# EAGLE design cnc_shield (EAGLE 5.10)
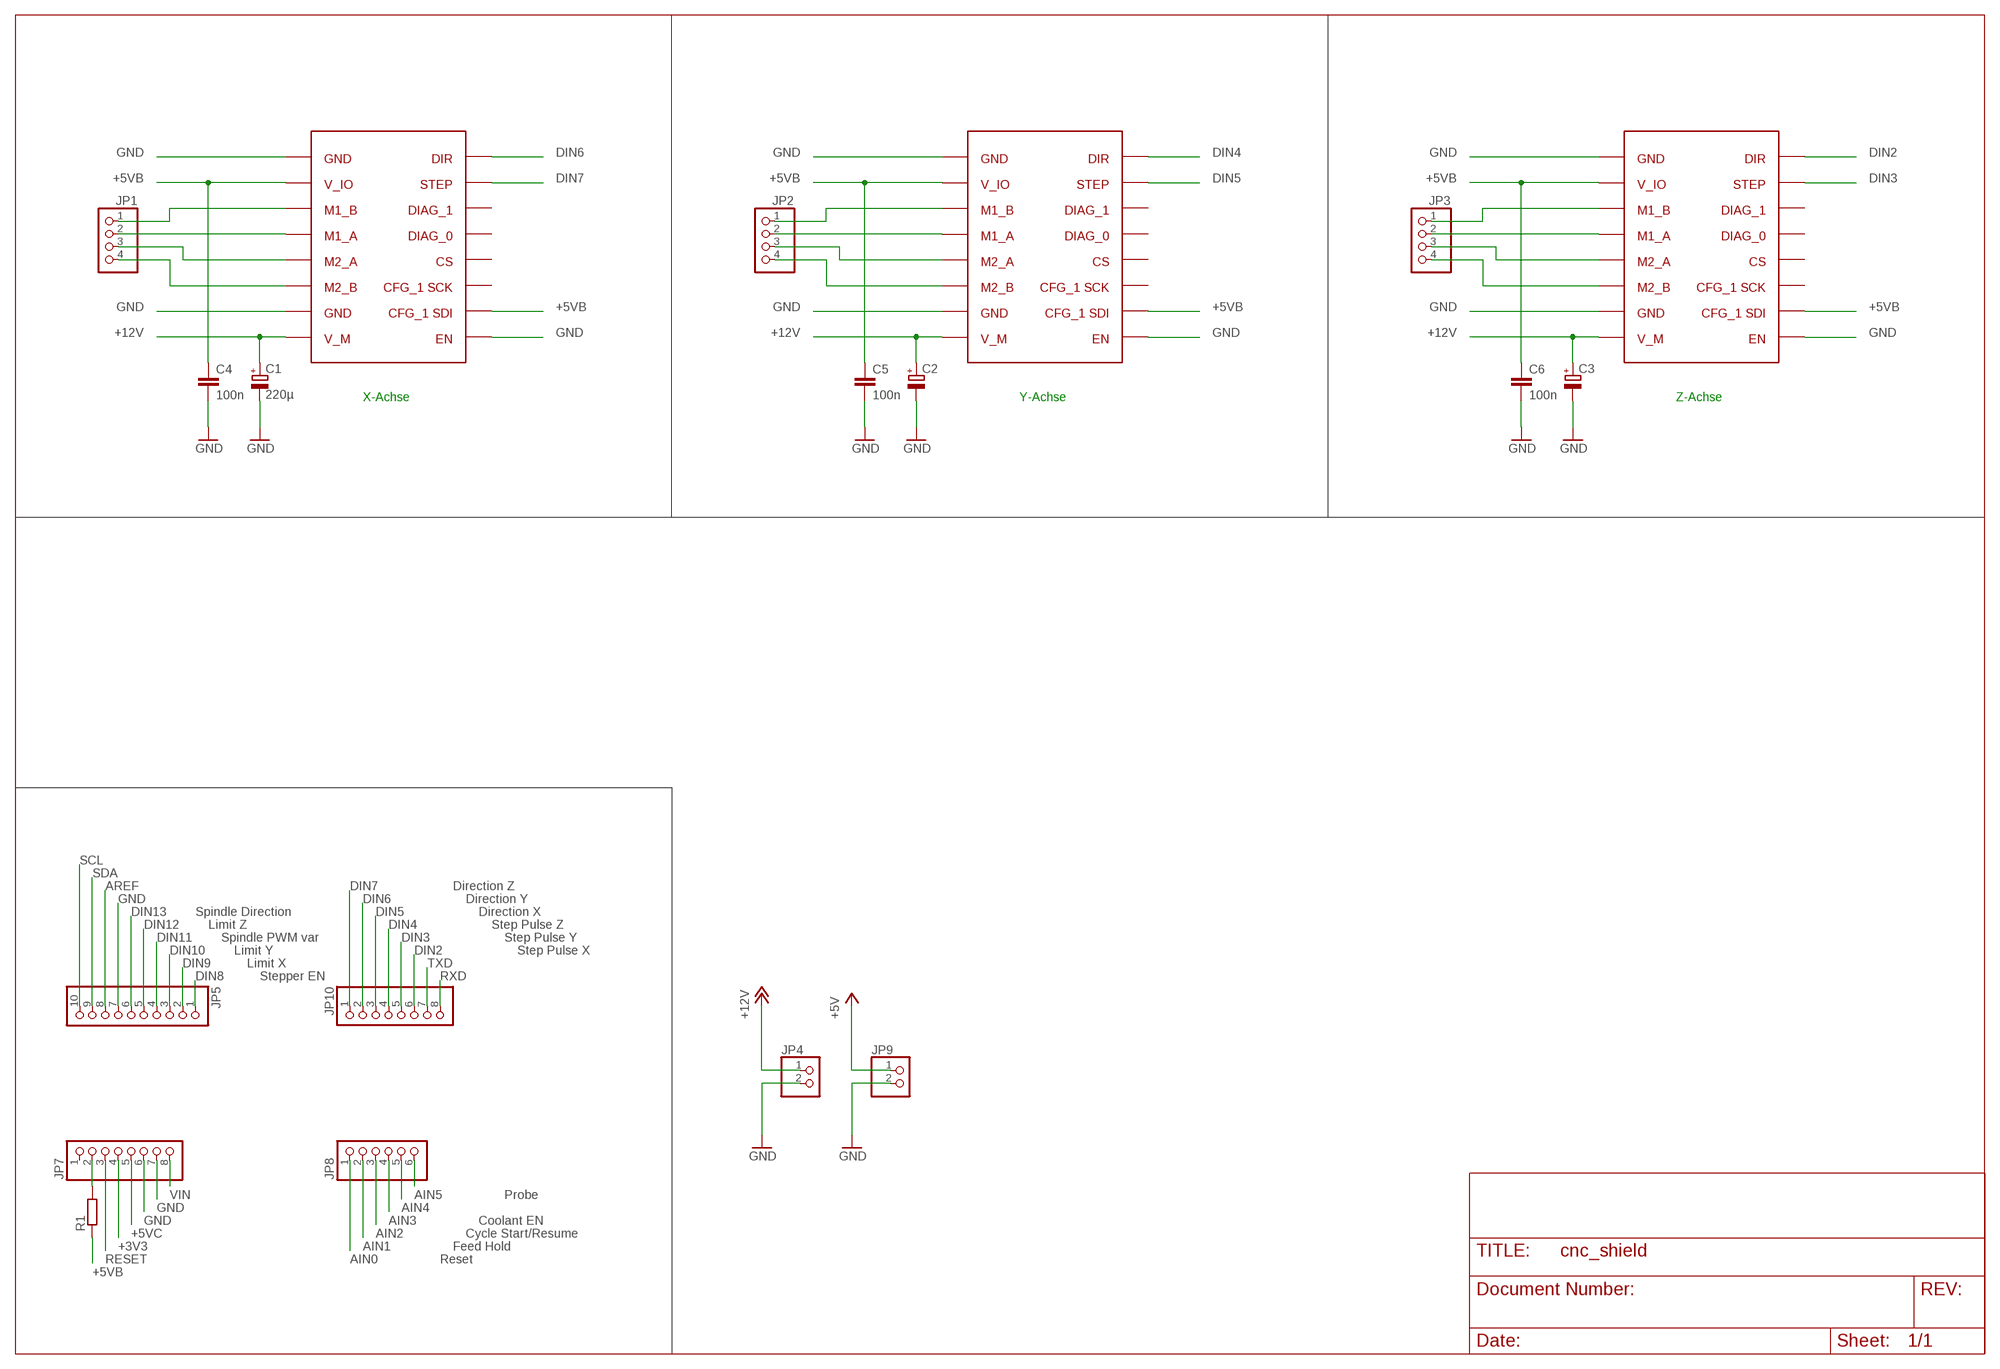
[diagram p0: schematic, sheet 1]

## Parts
C1  220µ  CPOL-EUTT2D4  [TT2D4]
C2  CPOL-EUTT2D4  [TT2D4]
C3  CPOL-EUTT2D4  [TT2D4]
C4  100n  C-EUC0805  [C0805]
C5  100n  C-EUC0805  [C0805]
C6  100n  C-EUC0805  [C0805]
JP1  PINHD-1X4  [1X04]
JP2  PINHD-1X4  [1X04]
JP3  PINHD-1X4  [1X04]
JP4  PINHD-1X2  [1X02]
JP5  PINHD-1X10  [1X10]
JP7  PINHD-1X8  [1X08]
JP8  PINHD-1X6  [1X06]
JP9  PINHD-1X2  [1X02]
JP10  PINHD-1X8  [1X08]
R1  R-EU_M1206  [M1206]
U$1  TMC2130  [TMC2130]
U$2  TMC2130  [TMC2130]
U$3  TMC2130  [TMC2130]

## Nets
+3V3: JP7.4
+5V: JP7.2 JP9.1 R1.2
+5VB: C4.1 C5.1 C6.1 R1.1 U$1.P$2(V_IO) U$1.P$10(CFG0_SDI) U$2.P$2(V_IO) U$2.P$10(CFG0_SDI) U$3.P$2(V_IO) U$3.P$10(CFG0_SDI)
+5VC: JP7.5
+12V: C1.+ C2.+ C3.+ JP4.1 U$1.P$8(V_M) U$2.P$8(V_M) U$3.P$8(V_M)
AIN0: JP8.1
AIN1: JP8.2
AIN2: JP8.3
AIN3: JP8.4
AIN4: JP8.5
AIN5: JP8.6
AREF: JP5.8
DIN2: JP10.6 U$3.P$16(DIR)
DIN3: JP10.5 U$3.P$15(STEP)
DIN4: JP10.4 U$2.P$16(DIR)
DIN5: JP10.3 U$2.P$15(STEP)
DIN6: JP10.2 U$1.P$16(DIR)
DIN7: JP10.1 U$1.P$15(STEP)
DIN8: JP5.1
DIN9: JP5.2
DIN10: JP5.3
DIN11: JP5.4
DIN12: JP5.5
DIN13: JP5.6
GND: C1.- C2.- C3.- C4.2 C5.2 C6.2 JP4.2 JP5.7 JP7.6 JP7.7 JP9.2 U$1.P$1(GND_IO) U$1.P$7(GND_M) U$1.P$9(EN) U$2.P$1(GND_IO) U$2.P$7(GND_M) U$2.P$9(EN) U$3.P$1(GND_IO) U$3.P$7(GND_M) U$3.P$9(EN)
N$1: JP2.1 U$2.P$3(M1B)
N$2: JP2.2 U$2.P$4(M1A)
N$3: JP1.1 U$1.P$3(M1B)
N$4: JP1.2 U$1.P$4(M1A)
N$5: JP1.3 U$1.P$5(M2A)
N$6: JP1.4 U$1.P$6(M2B)
N$7: JP2.3 U$2.P$5(M2A)
N$8: JP2.4 U$2.P$6(M2B)
N$9: JP3.1 U$3.P$3(M1B)
N$10: JP3.2 U$3.P$4(M1A)
N$11: JP3.3 U$3.P$5(M2A)
N$12: JP3.4 U$3.P$6(M2B)
RESET: JP7.3
RXD: JP10.8
SCL: JP5.10
SDA: JP5.9
TXD: JP10.7
VIN: JP7.8
Unconnected: JP7.1 U$1.P$11(CFG1_SCK) U$1.P$12(CS) U$1.P$13(DIAG_0) U$1.P$14(DIAG_1) U$2.P$11(CFG1_SCK) U$2.P$12(CS) U$2.P$13(DIAG_0) U$2.P$14(DIAG_1) U$3.P$11(CFG1_SCK) U$3.P$12(CS) U$3.P$13(DIAG_0) U$3.P$14(DIAG_1)

## Notes on the sheet
- X-Achse | Y-Achse | Z-Achse
- Direction Z
- Direction Y
- Spindle Direction | Direction X
- Limit Z | Step Pulse Z
- Spindle PWM var | Step Pulse Y
- Limit Y | Step Pulse X
- Limit X
- Stepper EN
- Probe
- Coolant EN
- Cycle Start/Resume
- Feed Hold
- Reset

## Library data of the parts
C1-C3 = rcl:CPOL-EU: POLARIZED CAPACITOR, European symbol
C4-C6 = rcl:C-EU: CAPACITOR, European symbol
JP1-JP3 = pinhead:PINHD-1X4: PIN HEADER
JP4 JP9 = pinhead:PINHD-1X2: PIN HEADER
JP5 = pinhead:PINHD-1X10: PIN HEADER
JP7 JP10 = pinhead:PINHD-1X8: PIN HEADER
JP8 = pinhead:PINHD-1X6: PIN HEADER
R1 = rcl:R-EU_: RESISTOR, European symbol
U$1-U$3 = tmc2130:TMC2130

## Board
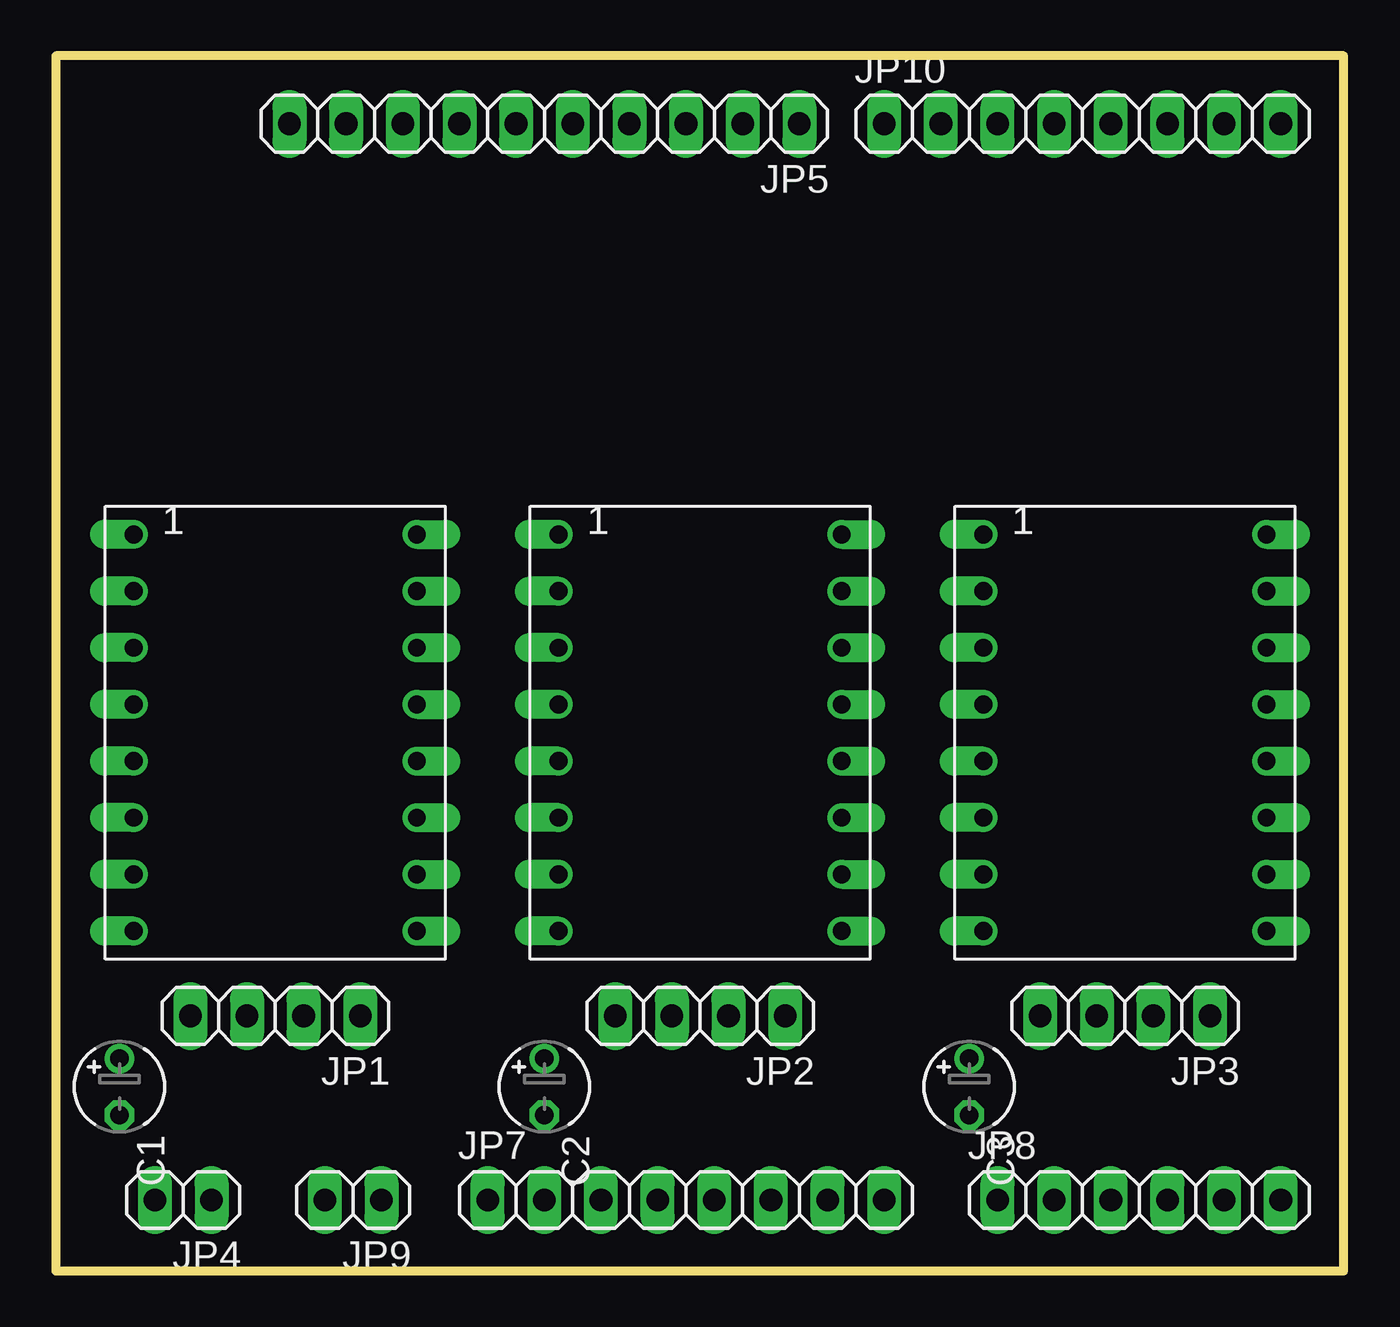
[diagram p1: board, top side]
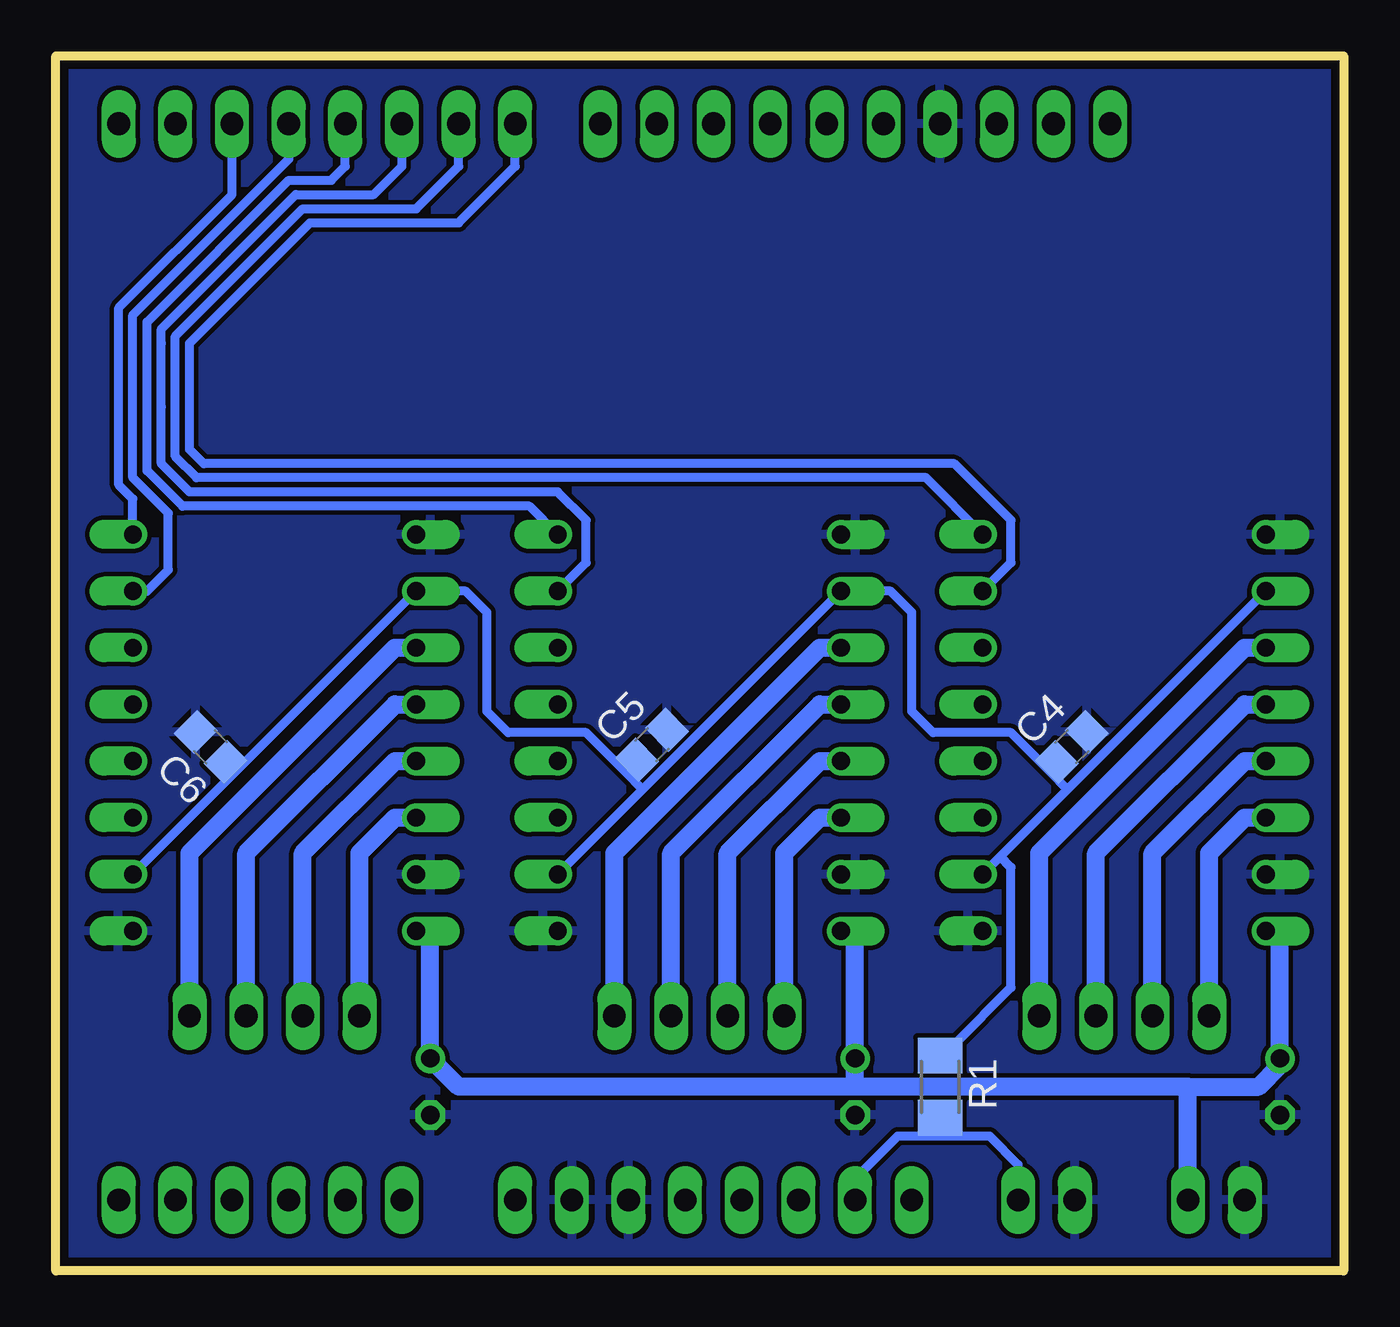
[diagram p2: board, bottom side, seen from below]

Size 57.75 x 54.48 mm. Coordinates in mm from the lower left corner, seen from the top.
Outline: 0,0 57.75,0 57.75,54.48 0,54.48 0,0
Copper layers (1*16): Top 0.035mm / dielectric 1.5mm / Bottom 0.035mm
Design rules "default *": minimum track width 10mil, minimum drill 24mil, track to track 8mil, track to pad 8mil, pad to pad 8mil, via to via 8mil, smd to smd 8mil, copper to edge 15mil, drill to drill 8mil, minimum pad ring 10mil, minimum via ring 8mil, stop-mask expansion 4mil, vias tented up to drill 0mil, thermal gap 10mil

### Footprints (pad centres in the part's own frame; a part is rotated, then mirrored left to right if it is on the bottom)
TT2D4 = drill 0.813 round: + -1.27,0 | drill 0.813 octagon: - 1.27,0
C0805 = smd 1.3 x 1.5: 1 -0.95,0; 2 0.95,0
1X04 = drill 1.016 long: 1 -3.81,0; 2 -1.27,0; 3 1.27,0; 4 3.81,0
1X02 = drill 1.016 long: 1 -1.27,0; 2 1.27,0
1X10 = drill 1.016 long: 1 -11.43,0; 2 -8.89,0; 3 -6.35,0; 4 -3.81,0; 5 -1.27,0; 6 1.27,0; 7 3.81,0; 8 6.35,0; 9 8.89,0; 10 11.43,0
1X08 = drill 1.016 long: 1 -8.89,0; 2 -6.35,0; 3 -3.81,0; 4 -1.27,0; 5 1.27,0; 6 3.81,0; 7 6.35,0; 8 8.89,0
1X06 = drill 1.016 long: 1 -6.35,0; 2 -3.81,0; 3 -1.27,0; 4 1.27,0; 5 3.81,0; 6 6.35,0
M1206 = smd 1.6 x 2: 1 -1.4,0; 2 1.4,0
TMC2130 = drill 0.8 offset: P$1 -6.35,8.89; P$2 -6.35,6.35; P$3 -6.35,3.81; P$4 -6.35,1.27; P$5 -6.35,-1.27; P$6 -6.35,-3.81; P$7 -6.35,-6.35; P$8 -6.35,-8.89; P$9 6.35,-8.89; P$10 6.35,-6.35; P$11 6.35,-3.81; P$12 6.35,-1.27; P$13 6.35,1.27; P$14 6.35,3.81; P$15 6.35,6.35; P$16 6.35,8.89

### Placement (x,y rotation side)
C1  2.86,8.26 270 top
C2  21.91,8.26 270 top
C3  40.96,8.26 270 top
C4  12.2,23.5 45 bottom
C5  31.02,23.59 45 bottom
C6  50.8,23.5 135 bottom
JP1  9.84,11.43 180 top
JP2  28.89,11.43 180 top
JP3  47.94,11.43 180 top
JP4  5.71,3.17 180 top
JP5  21.91,51.44 180 top
JP7  28.26,3.17 0 top
JP8  48.58,3.17 0 top
JP9  13.34,3.17 180 top
JP10  46.04,51.44 0 top
R1  18.1,8.26 270 bottom
U$1  9.84,24.13 0 top
U$2  28.89,24.13 0 top
U$3  47.94,24.13 0 top

### Tracks (layer width: path | path; a pad name or v marks a point on that pad's centre or on a via)
+5V
  Bottom 0.406: JP9.1 14.61,4.76 15.88,6.03 17.14,6.03 | 17.14,6.03 17.78,6.67 17.78,6.99 17.65,6.99 R1.2 | JP7.2 21.91,4.13 20,6.03 17.14,6.03
+5VB
  Bottom 0.406: 12.38,21.59 U$1.P$2 | 31.43,21.59 U$2.P$2 20.32,30.48 19.37,29.53 19.37,25.08 18.41,24.13 14.92,24.13 13.18,22.38 | 31.43,21.59 U$2.P$10 | 49.69,22.38 U$3.P$2 39.37,30.48 38.42,29.53 38.42,25.08 37.47,24.13 33.97,24.13 32.23,22.38 | 49.69,22.38 U$3.P$10 | 31.43,21.59 32.23,22.38 | 12.38,21.59 13.18,22.38 | 15.4,18.57 12.38,21.59 | 15.4,18.57 U$1.P$10 | 17.78,9.53 R1.1 17.46,10.16 14.92,12.7 14.92,18.1 15.4,18.57 | C4.1 12.87,22.69 13.18,22.38 | C5.1 | 32.23,22.38 C5.1 | 49.69,22.38 C6.1
+12V
  Bottom 0.813: U$1.P$8 2.86,15.24 C1.+ 2.86,9.21 3.81,8.26 6.99,8.26 | U$2.P$8 21.91,15.24 C2.+ 21.91,8.26 | U$3.P$8 40.96,15.24 C3.+ 39.69,8.26 21.91,8.26 | 6.99,8.26 21.91,8.26 | JP4.1 6.99,8.26
DIN2
  Bottom 0.406: 54.93,33.02 U$3.P$16 54.29,34.61 54.93,35.24 54.93,43.18 49.85,48.26 JP10.6
DIN3
  Bottom 0.406: U$3.P$15 53.66,30.48 52.7,31.43 52.7,33.97 54.29,35.56 54.29,42.86 47.31,49.85 JP10.5
DIN4
  Bottom 0.406: U$2.P$16 36.51,34.29 52.07,34.29 53.66,35.88 53.66,42.55 47.31,48.9 45.4,48.9 44.77,49.53 JP10.4
DIN5
  Bottom 0.406: U$2.P$15 33.97,31.75 33.97,33.66 35.24,34.92 51.75,34.92 53.02,36.2 53.02,38.73 53.02,41.59 53.02,42.23 46.99,48.26 43.5,48.26 42.23,49.53 JP10.3
DIN6
  Bottom 0.406: U$1.P$16 18.73,35.56 51.44,35.56 52.39,36.51 52.39,41.91 46.67,47.62 41.59,47.62 39.69,49.53 JP10.2
DIN7
  Bottom 0.406: U$1.P$15 14.92,31.75 14.92,33.66 17.46,36.2 51.12,36.2 51.75,36.83 51.75,41.59 46.35,46.99 39.69,46.99 37.15,49.53 JP10.1
GND
  pour Bottom: 0,0 57.75,0 57.75,54.48 0,54.48
N$1
  Bottom 0.813: U$2.P$3 23.5,27.94 32.7,18.73 JP2.1
N$2
  Bottom 0.813: U$2.P$4 23.5,25.4 30.16,18.73 JP2.2
N$3
  Bottom 0.813: U$1.P$3 4.45,27.94 13.65,18.73 JP1.1
N$4
  Bottom 0.813: U$1.P$4 4.45,25.4 11.11,18.73 JP1.2
N$5
  Bottom 0.813: U$1.P$5 4.45,22.86 8.57,18.73 JP1.3
N$6
  Bottom 0.813: U$1.P$6 4.45,20.32 6.03,18.73 JP1.4
N$7
  Bottom 0.813: U$2.P$5 23.5,22.86 27.62,18.73 JP2.3
N$8
  Bottom 0.813: U$2.P$6 23.5,20.32 25.08,18.73 JP2.4
N$9
  Bottom 0.813: U$3.P$3 42.55,27.94 51.75,18.73 JP3.1
N$10
  Bottom 0.813: U$3.P$4 42.55,25.4 49.21,18.73 JP3.2
N$11
  Bottom 0.813: U$3.P$5 42.55,22.86 46.67,18.73 JP3.3
N$12
  Bottom 0.813: U$3.P$6 42.55,20.32 44.13,18.73 JP3.4